# EAGLE design bat-phone Dodo v0.3 (EAGLE 9.1.3)
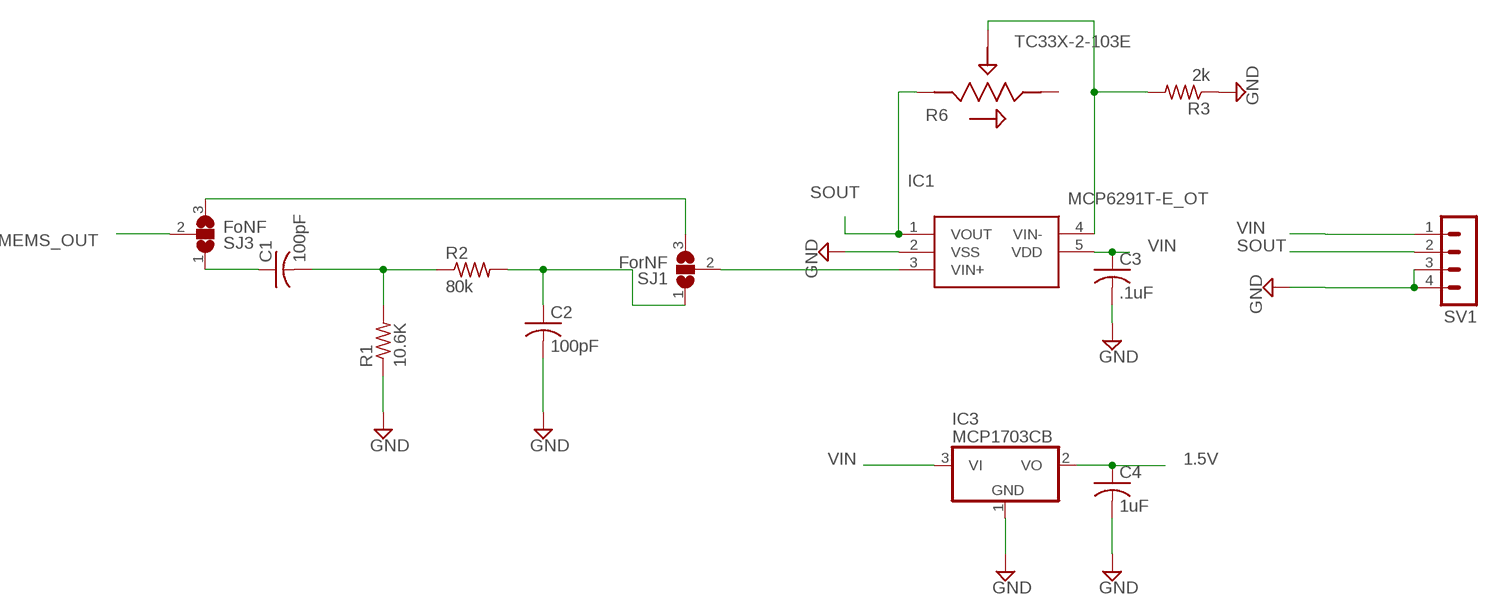
[diagram p0: schematic, sheet 1]

## Parts
C1  100pF  C-USC0603  [C0603]
C2  100pF  C-USC0603  [C0603]
C3  .1uF  C-USC0603  [C0603]
C4  1uF  C-USC0603  [C0603]
IC1  MCP6291T-E_OT  [SOT95P280X145-5N]
IC3  MCP1703CB  [SOT23]
R1  10.6K  R-US_R0603  [R0603]
R2  80k  R-US_R0603  [R0603]
R3  2k  R-US_R0603  [R0603]
R6  TC33X-2-103E  [35WR]
SJ1  ForNF  SJ2W  [SJ_2]
SJ3  FoNF  SJ2W  [SJ_2]
SV1  MA04-1  [MA04-1]

## Nets
1.5V: C4.1 IC3.2(VO)
GND: C2.2 C3.2 C4.2 IC1.2(VSS) IC3.1(GND) R1.1 R3.1 SV1.3 SV1.4
MEMS_OUT: SJ3.2
N$1: IC1.3(VIN+) SJ1.2
N$2: C1.2 R1.2 R2.1
N$3: C2.1 R2.2 SJ1.1
N$4: IC1.4(VIN-) R3.2 R6.2
N$5: SJ1.3 SJ3.3
N$6: C1.1 SJ3.1
SOUT: IC1.1(VOUT) R6.1 SV1.2
VIN: C3.1 IC1.5(VDD) IC3.3(VI) SV1.1
Unconnected: R6.3

## Library data of the parts
C1 C2 C4 = resistor:C-US: CAPACITOR, American symbol
C3 = resistor:C-US: CAPACITOR, American symbol; SPICEPREFIX: C
IC1 = MCP6291T-E_OT:MCP6291T-E_OT: Single 10MHz OpAmp,MCP6291T-E/OT Source: Datasheet <http://docs-emea.rs-online.com/webdocs/0d05/0900766b80d05c01.pdf>; ALLIED_NUMBER: 70046916; ALLIED_PRICE-STOCK: https://www.alliedelec.com/microchiptechnologyinc-mcp6291t-e-ot/70046916/; DESCRIPTION: Single 10MHz OpAmp,MCP6291T-E/OT; HEIGHT: 1.45mm; MANUFACTURER_NAME: Microchip; MANUFACTURER_PART_NUMBER: MCP6291T-E/OT; MOUSER_PART_NUMBER: 579-MCP6291T-E/OT; MOUSER_PRICE-STOCK: https://www.mouser.com/Search/Refine.aspx?Keyword=579-MCP6291T-E%2FOT; RS_PART_NUMBER: 8896089; RS_PRICE-STOCK: http://uk.rs-online.com/web/p/products/8896089
IC3 = MCP1703:MCP1703: 250 mA, 16V, Low Quiescent Current LDO Regulator Source: http://ww1.microchip.com/downloads/en/DeviceDoc/22049b.pdf
R1-R3 = resistor:R-US_: RESISTOR, American symbol
R6 = TC33X-2-103E:TC33X-2-103E: http://octopart.com/tc33x-2-103e-bourns-68150; AVAILABILITY: Unavailable; DESCRIPTION: Res Trimmer 10K Ohm 25% 0.1W_1/10W_ 1_Elec_/1_Mech_Turn _3 X 3.8mm_ Foot Print SMD Embossed T/R; MF: Bourns; MP: TC33X-2-103E; PACKAGE: FakePackage u; PRICE: None
SJ1 SJ3 = jumper:SJ2W: SMD solder JUMPER
SV1 = con-lstb:MA04-1: PIN HEADER; OC_FARNELL: unknown; OC_NEWARK: unknown

## Board
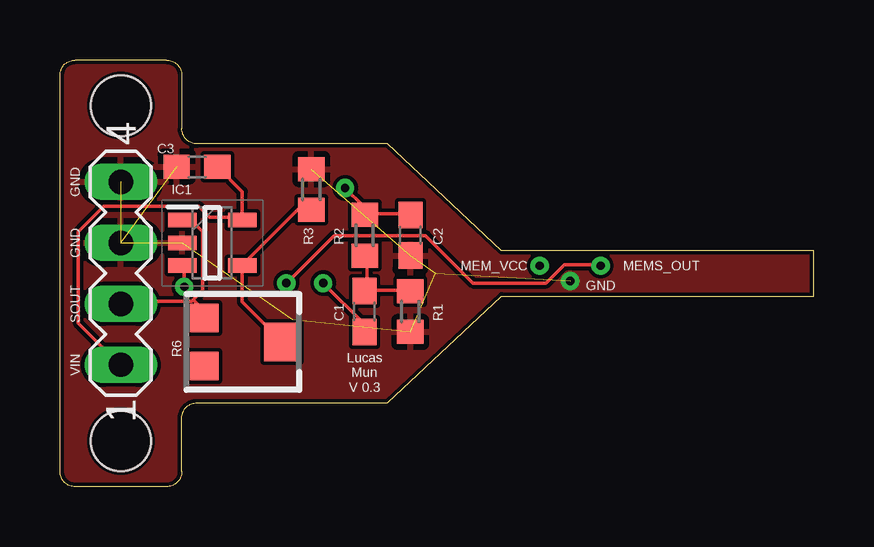
[diagram p1: board, top side]
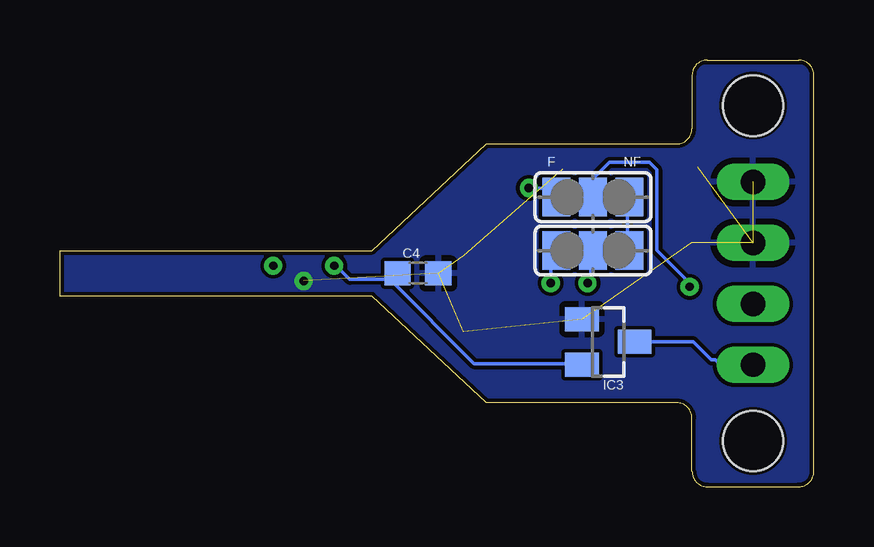
[diagram p2: board, bottom side, seen from below]

Size 31.43 x 17.78 mm. Coordinates in mm from the lower left corner, seen from the top.
Outline: 0,0.64 0,17.14 arc-90 0.64,17.78 4.45,17.78 arc-90 5.08,17.14 5.08,14.92 arc90 5.71,14.29 13.65,14.29 18.41,9.84 31.43,9.84 31.43,7.94 18.41,7.94 13.65,3.49 5.71,3.49 arc90 5.08,2.86 5.08,0.64 arc-90 4.45,0 0.64,0 arc-90 0,0.64
Copper layers (1*16): Top 0.035mm / dielectric 1.5mm / Bottom 0.035mm
Design rules "default *": minimum track width 6mil, minimum drill 0.35mm, track to track 6mil, track to pad 6mil, pad to pad 6mil, via to via 6mil, smd to smd 6mil, copper to edge 6mil, drill to drill 6mil, minimum pad ring 10mil, minimum via ring 8mil, stop-mask expansion 4mil, vias tented up to drill 0mil, thermal gap 10mil
Holes 2.51 mm at 2.54,1.91 2.54,15.88

### Footprints (pad centres in the part's own frame; a part is rotated, then mirrored left to right if it is on the bottom)
C0603 = smd 1.1 x 1: 1 -0.85,0; 2 0.85,0
SOT95P280X145-5N = smd 1.2 x 0.6: 1 -1.25,0.95; 2 -1.25,0; 3 -1.25,-0.95; 4 1.25,-0.95; 5 1.25,0.95
SOT23 = smd 1 x 1.4: 1 -0.95,-1.1; 2 0.95,-1.1; 3 0,1.1
R0603 = smd 1 x 1.1: 1 -0.85,0; 2 0.85,0
35WR = smd 1.2 x 1.2: 1 -1,-1.6; 3 1,-1.6 | smd 1.6 x 1.5: 2 0,1.65
SJ_2 = smd 1.168 x 1.6: 1 -1.524,0; 2 0,0; 3 1.524,0
MA04-1 = drill 1.016 long: 1 -3.81,0; 2 -1.27,0; 3 1.27,0; 4 3.81,0

### Placement (x,y rotation side)
C1  12.7,7.3 90 top
C2  14.61,10.48 270 top
C3  5.71,13.34 180 top
C4  16.51,8.89 0 bottom
IC1  6.35,10.16 0 top
IC3  8.57,6.03 270 bottom
R1  14.61,7.3 90 top
R2  12.7,10.48 90 top
R3  10.48,12.38 270 top
R6  7.62,6.03 270 top
SJ1  9.21,12.07 0 bottom
SJ3  9.21,9.84 0 bottom
SV1  2.54,8.89 90 top

### Tracks (layer width: path | path; a pad name or v marks a point on that pad's centre or on a via)
1.5V  (via drill 0.35)
  Bottom 0.152: 17.68,8.64 17.53,8.64 17.37,8.79 C4.1 17.68,8.64 | 17.68,8.64 19.36,8.64 19.81,9.09 19.96,9.09 v20,9.21 | 17.68,8.64 14.17,5.13 9.75,5.13 IC3.2
GND  (via drill 0.35)  (9 unrouted)
  other vias: 21.27,8.57
  pour Top: -4.45,22.86 -4.45,-4.76 40.32,-4.76 40.32,22.86
  pour Bottom: -1.91,20.64 -1.91,-1.91 34.29,-1.91 34.29,20.64
MEMS_OUT  (via drill 0.35)
  Top 0.152: v22.54,9.21 22.4,9.25 21.03,9.25 20.27,8.48 17.22,8.48 15.24,10.46 11.43,10.46 v9.45,8.48 v9.44,8.48
  Bottom 0.152: v9.44,8.48 9.3,8.48 9.3,9.7 SJ3.2
N$1  (via drill 0.35)
  Top 0.152: v5.18,8.33 5.18,9.09 IC1.3
  Bottom 0.152: v5.18,8.33 5.18,8.48 6.55,9.86 6.55,13.21 6.86,13.51 8.53,13.51 9.14,12.9 9.14,12.14 SJ1.2
N$2
  Top 0.152: 12.8,8.18 12.8,9.55 R2.1 | 12.8,8.18 14.48,8.18 R1.2 | 12.8,8.18 C1.2
N$3  (via drill 0.35)
  Top 0.152: v11.89,12.45 12.65,11.68 12.65,11.38 R2.2 12.8,11.38 14.48,11.38 C2.1
  Bottom 0.152: v11.89,12.45 11.12,12.45 10.82,12.14 SJ1.1
N$4
  Top 0.152: R3.2 10.36,11.53 9.91,11.53 7.62,9.25 IC1.4 | 7.62,9.09 IC1.4 | IC1.4 7.6,7.7 R6.2
N$5
  Bottom 0.152: SJ3.3 7.77,9.86 7.77,11.99 SJ1.3
N$6  (via drill 0.35)
  Top 0.152: v10.97,8.48 12.65,6.81 12.65,6.5 C1.1
  Bottom 0.152: v10.97,8.48 10.97,9.55 10.82,9.7 SJ3.1
SOUT
  Top 0.152: 5.55,7.79 5.49,7.72 2.59,7.72 SV1.2 | 5.55,7.79 5.94,8.18 5.94,10.62 5.49,11.07 5.18,11.07 IC1.1 | R6.1 6.02,7.32 5.55,7.79
VIN
  Top 0.152: 7.62,11.23 IC1.5 | IC1.5 7.47,11.23 6.25,11.23 5.79,11.68 1.83,11.68 0.76,10.62 0.76,6.81 2.44,5.13 SV1.1 | IC1.5 7.6,12.3 C3.1
  Bottom 0.152: IC3.3 7.47,6.04 5.03,6.04 4.27,5.28 4.12,5.28 3.96,5.13 2.59,5.13 SV1.1

### Text on the board
tPlace: Lucas / Mun / V 0.3
bPlace: NF | F
tNames: GND | GND | MEM_VCC | MEMS_OUT | GND | SOUT | VIN
Document: Created 3/8/2019 | Lucas Mun | Board was created in mil | Dimension markings are in mm